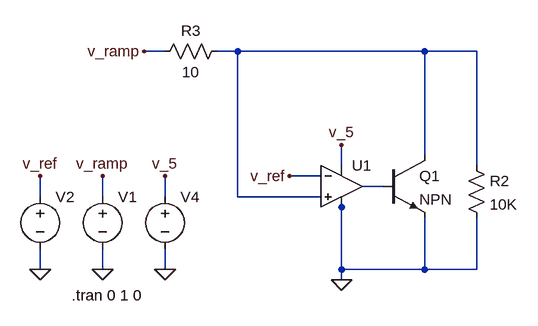
[diagram p0: schematic main.asc]
main.asc, the LTspice schematic file:
Version 4
SHEET 1 1160 680
WIRE 416 32 384 32
WIRE 528 32 496 32
WIRE 816 32 528 32
WIRE 896 32 816 32
WIRE 816 192 816 32
WIRE 688 208 688 176
WIRE 896 208 896 32
WIRE 656 224 608 224
WIRE 752 240 720 240
WIRE 224 256 224 224
WIRE 320 256 320 224
WIRE 416 256 416 224
WIRE 528 256 528 32
WIRE 656 256 528 256
WIRE 688 272 688 256
WIRE 224 368 224 336
WIRE 320 368 320 336
WIRE 416 368 416 336
WIRE 688 368 688 272
WIRE 816 368 816 288
WIRE 816 368 688 368
WIRE 896 368 896 288
WIRE 896 368 816 368
WIRE 688 384 688 368
FLAG 320 368 0
FLAG 320 224 v_ramp
FLAG 688 384 0
FLAG 688 176 v_5
FLAG 416 368 0
FLAG 416 224 v_5
FLAG 384 32 v_ramp
FLAG 224 368 0
FLAG 224 224 v_ref
FLAG 608 224 v_ref
SYMBOL voltage 320 240 R0
WINDOW 3 24 96 Invisible 2
WINDOW 123 0 0 Left 2
WINDOW 39 0 0 Left 2
SYMATTR Value PULSE(0 5 0 0.01 0.0000001 0.0000001 0.010001)
SYMATTR InstName V1
SYMBOL npn 752 192 R0
SYMATTR InstName Q1
SYMBOL voltage 416 240 R0
WINDOW 3 24 96 Invisible 2
WINDOW 123 0 0 Left 2
WINDOW 39 0 0 Left 2
SYMATTR Value 10
SYMATTR InstName V4
SYMBOL Opamps\\UniversalOpamp2 688 240 R0
SYMATTR InstName U1
SYMBOL res 880 192 R0
SYMATTR InstName R2
SYMATTR Value 10K
SYMBOL res 512 16 R90
WINDOW 0 0 56 VBottom 2
WINDOW 3 32 56 VTop 2
SYMATTR InstName R3
SYMATTR Value 10
SYMBOL voltage 224 240 R0
WINDOW 3 24 96 Invisible 2
WINDOW 123 0 0 Left 2
WINDOW 39 0 0 Left 2
SYMATTR Value 3.1
SYMATTR InstName V2
TEXT 272 408 Left 2 !.tran 0 1 0

The netlist it stands for:
* main.asc
V1 v_ramp 0 PULSE(0 5 0 0.01 0.0000001 0.0000001 0.010001)
Q1 N001 N002 0 0 NPN
V4 v_5 0 10
XU1 N001 v_ref v_5 0 N002 level.2 Avol=1Meg GBW=10Meg Slew=10Meg ilimit=25m rail=0 Vos=0 phimargin=45 en=0 enk=0 in=0 ink=0 Rin=500Meg  ; pins IN+ IN- V+ V- OUT
R2 N001 0 10K
R3 N001 v_ramp 10
V2 v_ref 0 3.1
.model NPN NPN
.model PNP PNP
.lib standard.bjt
.tran 0 1 0
.lib UniversalOpamps2.sub
.backanno
.end